# Altium project project1.PrjPcb
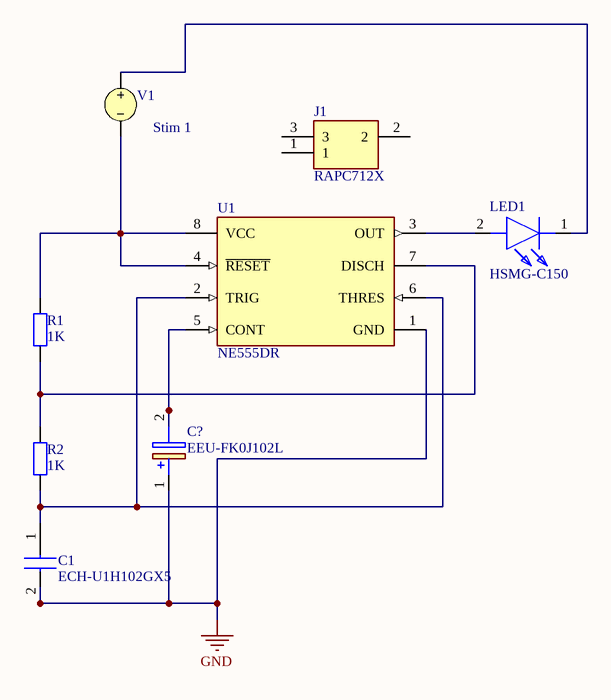
[diagram p0: project1.SchDoc]
1 sheet, 8 parts. Net scope: global (net labels, ports and power ports of the same name join across sheets).
Board file: project1.PcbDoc

## Sheet project1.SchDoc
size A4; SheetNumber: 1; SheetTotal: 1

### Parts
(Parts that share a designator on the sheet are numbered #1, #2 ... from top to bottom, then left to right.)
C1#1  EEU-FK0J102L  [CAPPRD350W65D800H1650]
C1#2  ECH-U1H102GX5  [ECHU_J1_J2_17_21]
J1  RAPC712X  [RAPC712X_1]
LED1  HSMG-C150  [LEDC3216X120N]
R1  value 1K  [AXIAL-0.4]
R2  value 1K  [AXIAL-0.4]
U1  NE555DR  [FP-D0008A-IPC_A]
V1  Stim 1

### Nets
GND: C1#1.1(+) C1#2.2 U1.1(GND)
NetC1#1_2: C1#1.2(-) U1.5(CONT)
NetC1#2_1: C1#2.1 R2.1 U1.2(TRIG) U1.6(THRES)
NetLED1_1: LED1.1(K) V1.1
NetLED1_2: LED1.2(A) U1.3(OUT)
NetR1_1: R1.1 R2.2 U1.7(DISCH)
NetR1_2: R1.2 U1.4(~{RESET}) U1.8(VCC) V1.2

Not connected (* = marked no-connect by the designer): J1 1 2 3

### Library data of the parts
C1#1 = EEU-FK0J102L: Capacitor Polarised; Manufacturer_Name: Panasonic; Datasheet Link: http://industrial.panasonic.com/cdbs/www-data/pdf/RDI0000/ABD0000C173.pdf; Manufacturer_Part_Number: ECH-U1H102GX5; Mouser Part Number: 667-ECH-U1H102GX5; Mouser Price/Stock: https://www.mouser.co.uk/ProductDetail/Panasonic/ECH-U1H102GX5?qs=DWeLBnRir%2FIlo4Nc0F6AmQ%3D%3D; Arrow Part Number: ECH-U1H102GX5; Arrow Price/Stock: https://www.arrow.com/en/products/echu1h102gx5/panasonic?region=europe
C1#2 = ECH-U1H102GX5: Capacitor; Manufacturer_Name: Panasonic; Datasheet Link: http://industrial.panasonic.com/cdbs/www-data/pdf/RDF0000/ABA0000C1015.pdf; Height: 16.5mm; Manufacturer_Part_Number: EEU-FK0J102L
J1 = RAPC712X: Connector; Manufacturer_Name: Switchcraft; Datasheet Link: http://www.switchcraft.com/Drawings/rapc712x_cd.pdf; Manufacturer_Part_Number: RAPC712X; Mouser Part Number: 502-RAPC712X; Mouser Price/Stock: https://www.mouser.co.uk/ProductDetail/Switchcraft/RAPC712X?qs=QGk6feVlqMKeDw5ej1aubA%3D%3D; Arrow Part Number: RAPC712X; Arrow Price/Stock: https://www.arrow.com/en/products/rapc712x/switchcraft?utm_currency=USD&region=nac
LED1 = HSMG-C150: LED; Manufacturer_Name: Avago Technologies; Datasheet Link: https://docs.broadcom.com/docs/AV02-0551EN; Height: 1.2mm; Manufacturer_Part_Number: HSMG-C150; Mouser Part Number: 630-HSMG-C150; Mouser Price/Stock: https://www.mouser.co.uk/ProductDetail/Broadcom-Avago/HSMG-C150?qs=YDL0qNrpDT6zJe9nNPPiZQ%3D%3D
R1 R2 = Res2: Resistor; Published: 8-Jun-2000; LatestRevisionDate: 17-Jul-2002; LatestRevisionNote: Re-released for DXP Platform.; PackageReference: AXIAL-0.4; Publisher: Altium Limited; PackageDescription: Axial Device, Thru-Hole; 2 Leads; 0.4 in Pin Spacing
U1 = CMP-1685-00007-2: IC OSC SGL TIMER 100KHZ 8-SOIC; Low Level Output Current: 200mA; Quiescent Current: 15mA; Min Supply Voltage: 4.5V; Number of Timers/Counters: 1; Max Supply Voltage: 16V; Operating Supply Current: 10mA; High Level Output Current: -200mA; Packaging: Tape and Reel; Frequency: 100kHz; Weight: 0.002561oz; REACH SVHC: No SVHC; Package Quantity: 2500; Width: 3.91mm; Max Operating Temperature: 70°C; Contact Plating: Gold; Lead Free: Lead Free; Number of Pins: 8; Min Operating Temperature: 0°C; Radiation Hardening: No; Length: 4.9mm; Case/Package: SOIC; Height: 1.58mm; Mount: Surface Mount
V1 = VSRC: Voltage Source; Note: PCB Footprint - Not required; AC Magnitude: 1; AC Phase: 0; DC Magnitude: 2; Frequency: 1Meg; Published: 8-Jun-2000; LatestRevisionDate: 17-Jul-2002; LatestRevisionNote: Re-released for DXP Platform.; PackageReference: Not Applicable; Publisher: Altium Limited; Offset: 0; Amplitude: 1; Delay: 0; Damping Factor: 0; Phase: 0